# EAGLE design M708B (EAGLE 6.6.0)
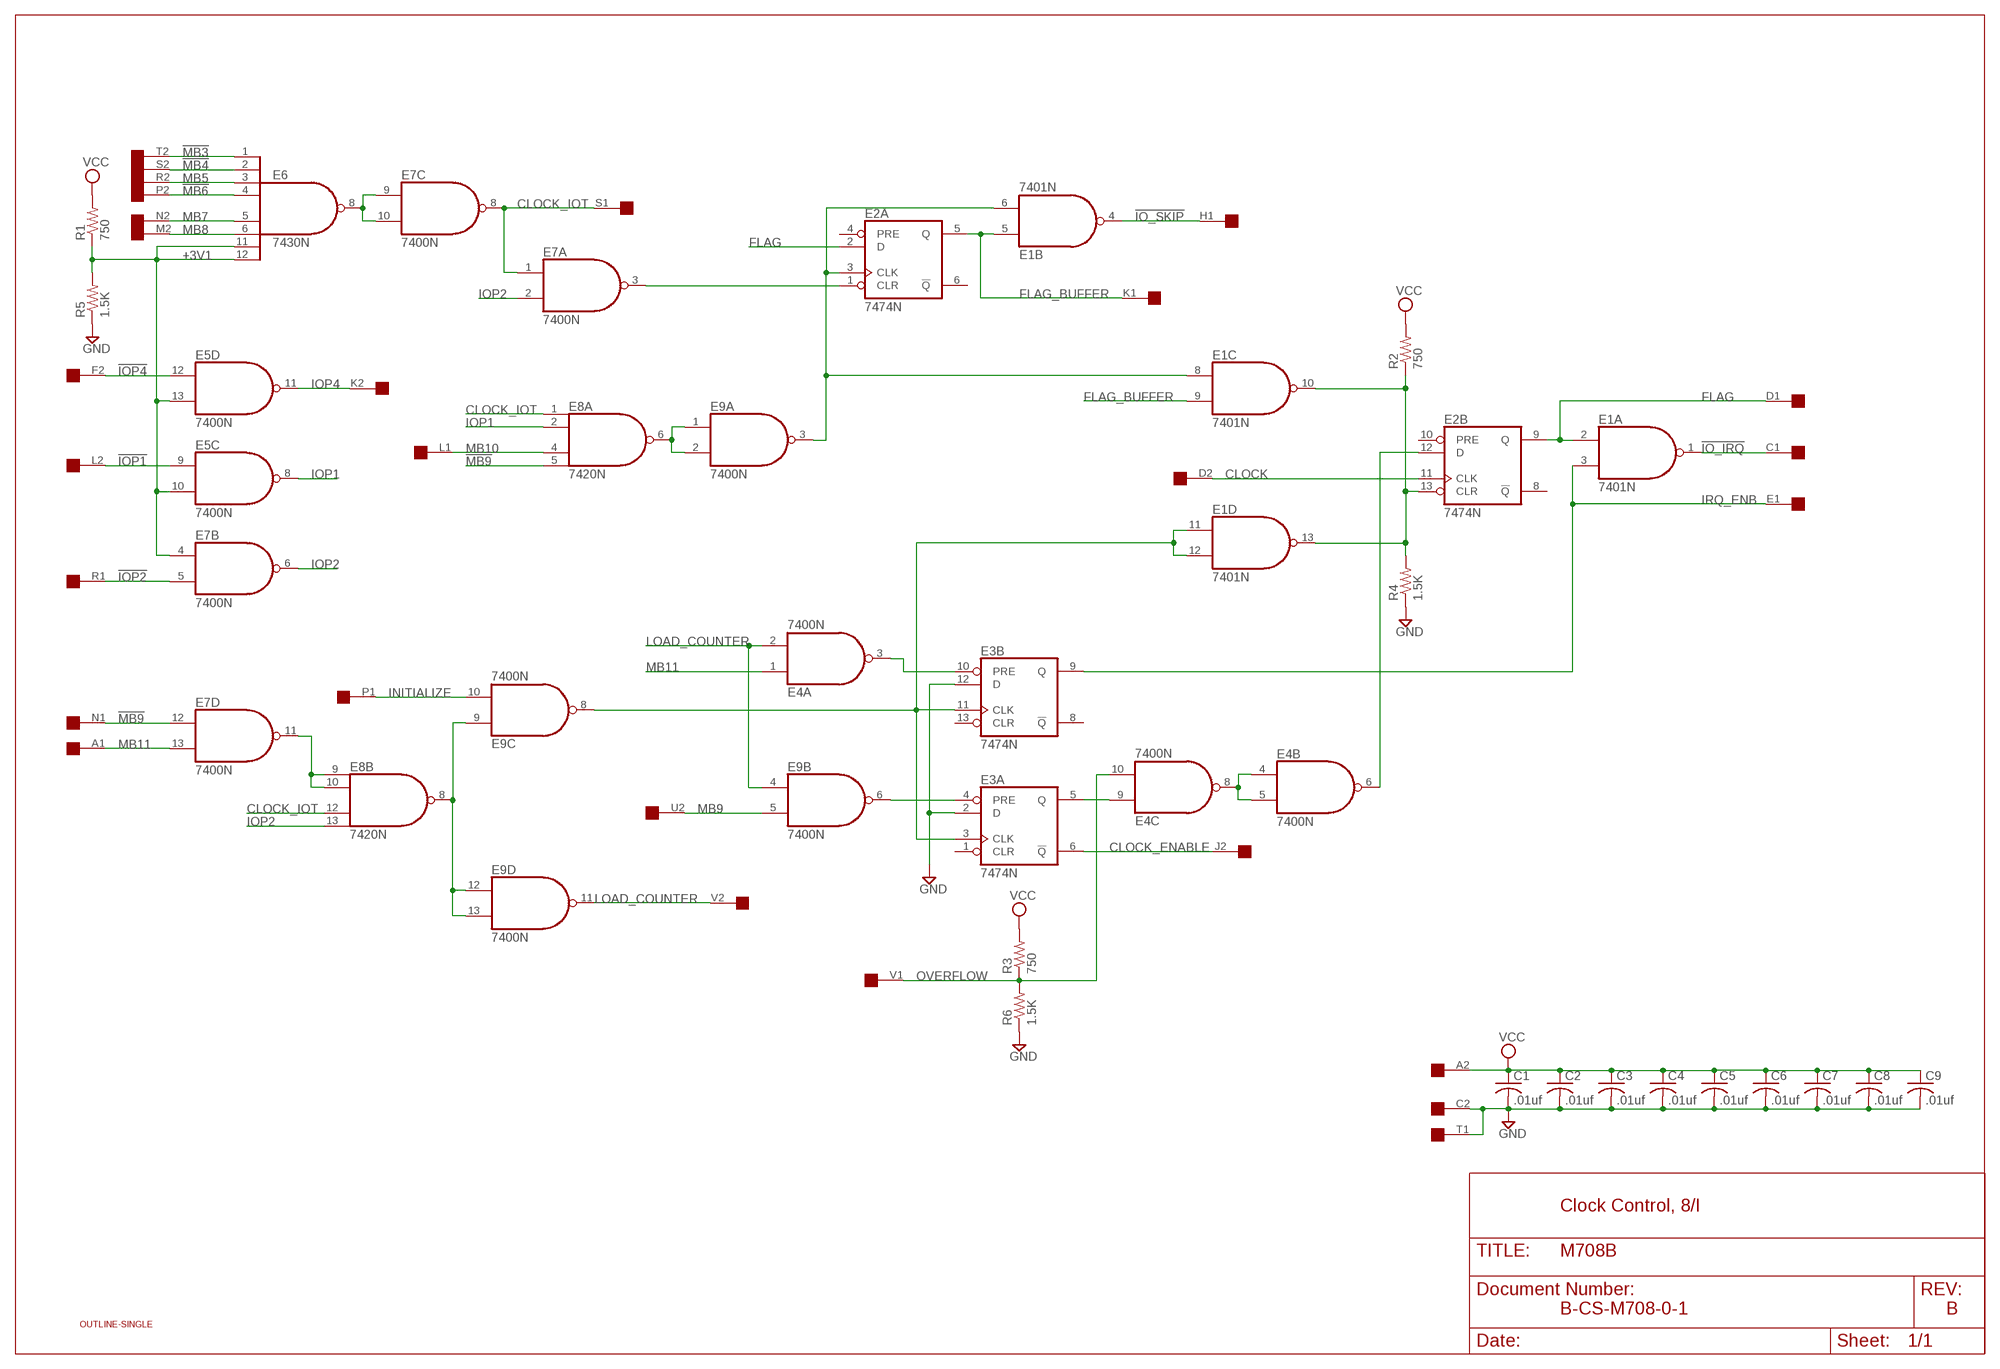
[diagram p0: schematic, sheet 1]

## Parts
C1  .01uf  C-US075-032X103  [C075-032X103]
C2  .01uf  C-US075-032X103  [C075-032X103]
C3  .01uf  C-US075-032X103  [C075-032X103]
C4  .01uf  C-US075-032X103  [C075-032X103]
C5  .01uf  C-US075-032X103  [C075-032X103]
C6  .01uf  C-US075-032X103  [C075-032X103]
C7  .01uf  C-US075-032X103  [C075-032X103]
C8  .01uf  C-US075-032X103  [C075-032X103]
C9  .01uf  C-US075-032X103  [C075-032X103]
E1  7401N  74LS01N  [DIL14]
E2  7474N  74S74N  [DIL14]
E3  7474N  74S74N  [DIL14]
E4  7400N  [DIL14]
E5  7400N  [DIL14]
E6  7430N  [DIL14]
E7  7400N  [DIL14]
E8  7420N  74S20N  [DIL14]
E9  7400N  [DIL14]
R1  750  R-US_0207/10  [0207/10]
R2  750  R-US_0207/10  [0207/10]
R3  750  R-US_0207/10  [0207/10]
R4  1.5K  R-US_0207/10  [0207/10]
R5  1.5K  R-US_0207/10  [0207/10]
R6  1.5K  R-US_0207/10  [0207/10]
U$1  SINGLE  [EDGE-CON2]
U$4  OUTLINE-SINGLE  [SINGLE]

## Nets
!CLR_FLAG: E1.10(C:O) E1.13(D:O) E2.13(B:CLR) R2.1 R4.2
!IO_IRQ: E1.1(A:O) U$1.C1
!IO_SKIP: E1.4(B:O) U$1.H1
!IOP1: E5.9(C:I0) U$1.L2
!IOP2: E7.5(B:I1) U$1.R1
!IOP4: E5.12(D:I0) U$1.F2
!MB3: E6.1(I0) U$1.T2
!MB4: E6.2(I1) U$1.S2
!MB6: E6.4(I3) U$1.P2
!MB9: E7.12(D:I0) E8.5(A:I3) U$1.N1
+3V1: E5.10(C:I1) E5.13(D:I1) E6.11(I6) E6.12(I7) E7.4(B:I0) R1.1 R5.2
CLOCK: E2.11(B:CLK) U$1.D2
CLOCK_ENABLE: E3.6(A:!Q) U$1.J2
CLOCK_IOT: E7.1(A:I0) E7.8(C:O) E8.1(A:I0) E8.12(B:I2) U$1.S1
FLAG: E1.2(A:I0) E2.2(A:D) E2.9(B:Q) U$1.D1
FLAG_BUFFER: E1.5(B:I0) E1.9(C:I1) E2.5(A:Q) U$1.K1
GND [Supply]: C1.2 C2.2 C3.2 C4.2 C5.2 C6.2 C7.2 C8.2 C9.2 E3.2(A:D) E3.12(B:D) R4.1 R5.1 R6.1 U$1.C2 U$1.T1
INITIALIZE: E9.10(C:I1) U$1.P1
IOP1: E5.8(C:O) E8.2(A:I1)
IOP2: E7.2(A:I1) E7.6(B:O) E8.13(B:I3)
IOP4: E5.11(D:O) U$1.K2
IRQ_ENB: E1.3(A:I1) E3.9(B:Q) U$1.E1
LOAD_COUNTER: E4.2(A:I1) E9.4(B:I0) E9.11(D:O) U$1.V2
MB5: E6.3(I2) U$1.R2
MB7: E6.5(I4) U$1.N2
MB8: E6.6(I5) U$1.M2
MB9: E9.5(B:I1) U$1.U2
MB10: E8.4(A:I2) U$1.L1
MB11: E4.1(A:I0) E7.13(D:I1) U$1.A1
N$14: E1.11(D:I0) E1.12(D:I1) E3.3(A:CLK) E3.11(B:CLK) E9.8(C:O)
N$26: E6.8(O) E7.9(C:I0) E7.10(C:I1)
N$29: E2.1(A:CLR) E7.3(A:O)
N$31: E8.6(A:O) E9.1(A:I0) E9.2(A:I1)
N$32: E1.6(B:I1) E1.8(C:I0) E2.3(A:CLK) E9.3(A:O)
N$34: E7.11(D:O) E8.9(B:I0) E8.10(B:I1)
N$35: E8.8(B:O) E9.9(C:I0) E9.12(D:I0) E9.13(D:I1)
N$36: E3.5(A:Q) E4.9(C:I0)
N$37: E3.4(A:PRE) E9.6(B:O)
N$38: E3.10(B:PRE) E4.3(A:O)
N$40: E4.4(B:I0) E4.5(B:I1) E4.8(C:O)
N$41: E2.12(B:D) E4.6(B:O)
OVERFLOW: E4.10(C:I1) R3.1 R6.2 U$1.V1
VCC [Supply]: C1.1 C2.1 C3.1 C4.1 C5.1 C6.1 C7.1 C8.1 C9.1 R1.2 R2.2 R3.2 U$1.A2
Unconnected: E2.4(A:PRE) E2.6(A:!Q) E2.8(B:!Q) E2.10(B:PRE) E3.1(A:CLR) E3.8(B:!Q) E3.13(B:CLR) E4.11(D:O) E4.12(D:I0) E4.13(D:I1) E5.1(A:I0) E5.2(A:I1) E5.3(A:O) E5.4(B:I0) E5.5(B:I1) E5.6(B:O) U$1.B1 U$1.B2 U$1.E2 U$1.F1 U$1.H2 U$1.J1 U$1.M1 U$1.U1

## Notes on the sheet
- Clock Control, 8/I
- B-CS-M708-0-1 | B

## Power pins joined to a net without a drawn wire
GND: E1.7(P:GND) E2.7(P:GND) E3.7(P:GND) E4.7(P:GND) E5.7(P:GND) E6.7(GND) E7.7(P:GND) E8.7(P:GND) E9.7(P:GND)
VCC: E1.14(P:VCC) E2.14(P:VCC) E3.14(P:VCC) E4.14(P:VCC) E5.14(P:VCC) E6.14(VCC) E7.14(P:VCC) E8.14(P:VCC) E9.14(P:VCC)

## Library data of the parts
C1-C9 = rcl:C-US: CAPACITOR, American symbol
E1 = 74xx-us:74*01: Quad 2-input NAND gate, open collector
E2 E3 = 74xx-us:74*74: Dual D type positive edge triggered FLIP FLOP, preset and clear
E4 E5 E7 E9 = 74xx-us:74*00: Quad 2-input NAND gate
E6 = 74xx-us:74*30: 8-input NAND gate
E8 = 74xx-us:74*20: Dual 4-input NAND gate
R1-R6 = rcl:R-US_: RESISTOR, American symbol
U$1 = dec-con:SINGLE: Single-Height DEC board
U$4 = dec-con:OUTLINE-*: Board outlines for DEC boards.

## Net classes
1 Supply: width 0.813 mm

## Board
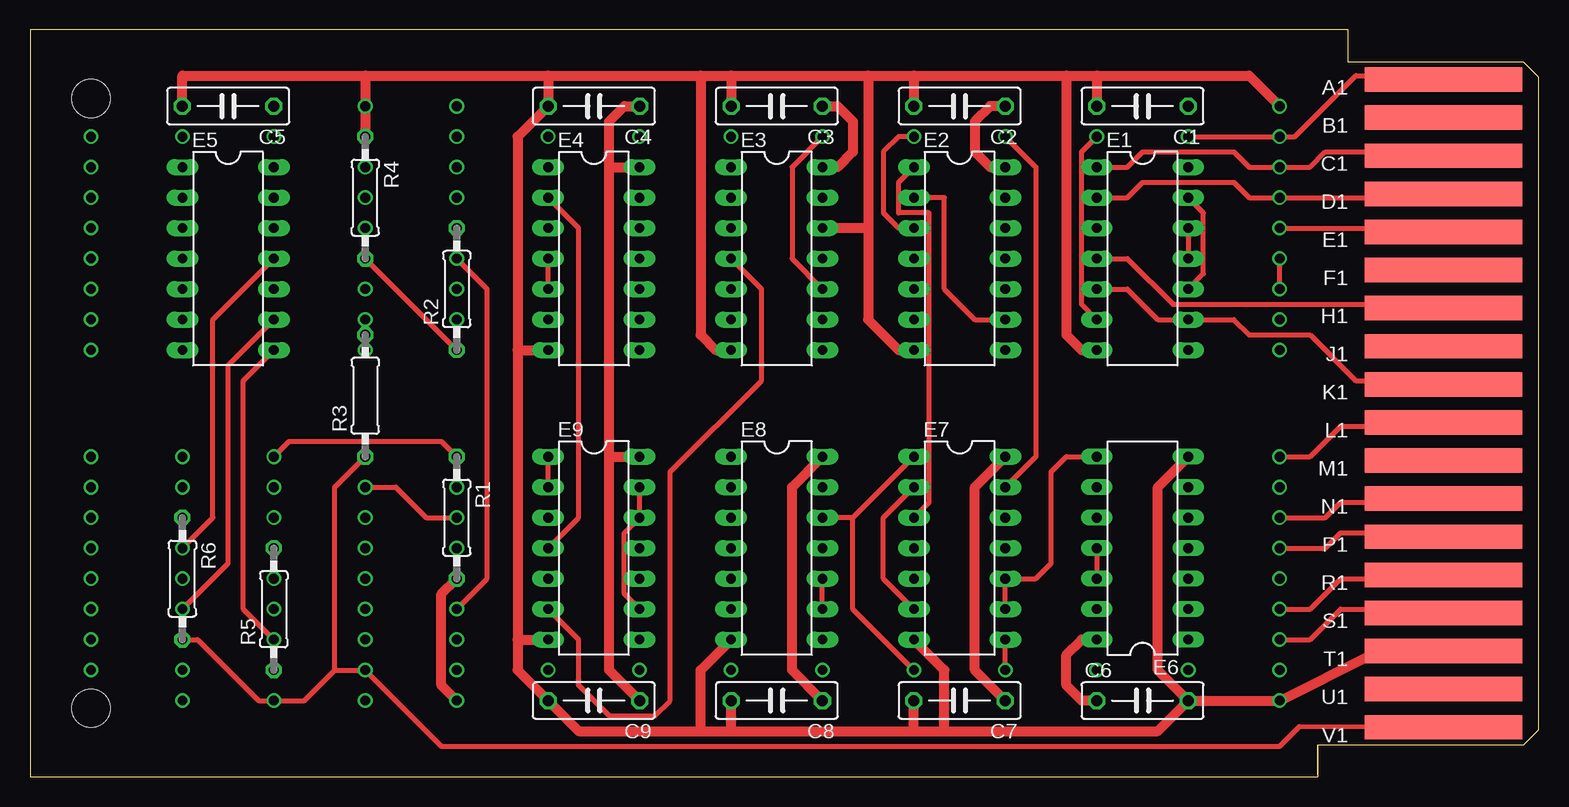
[diagram p1: board, top side]
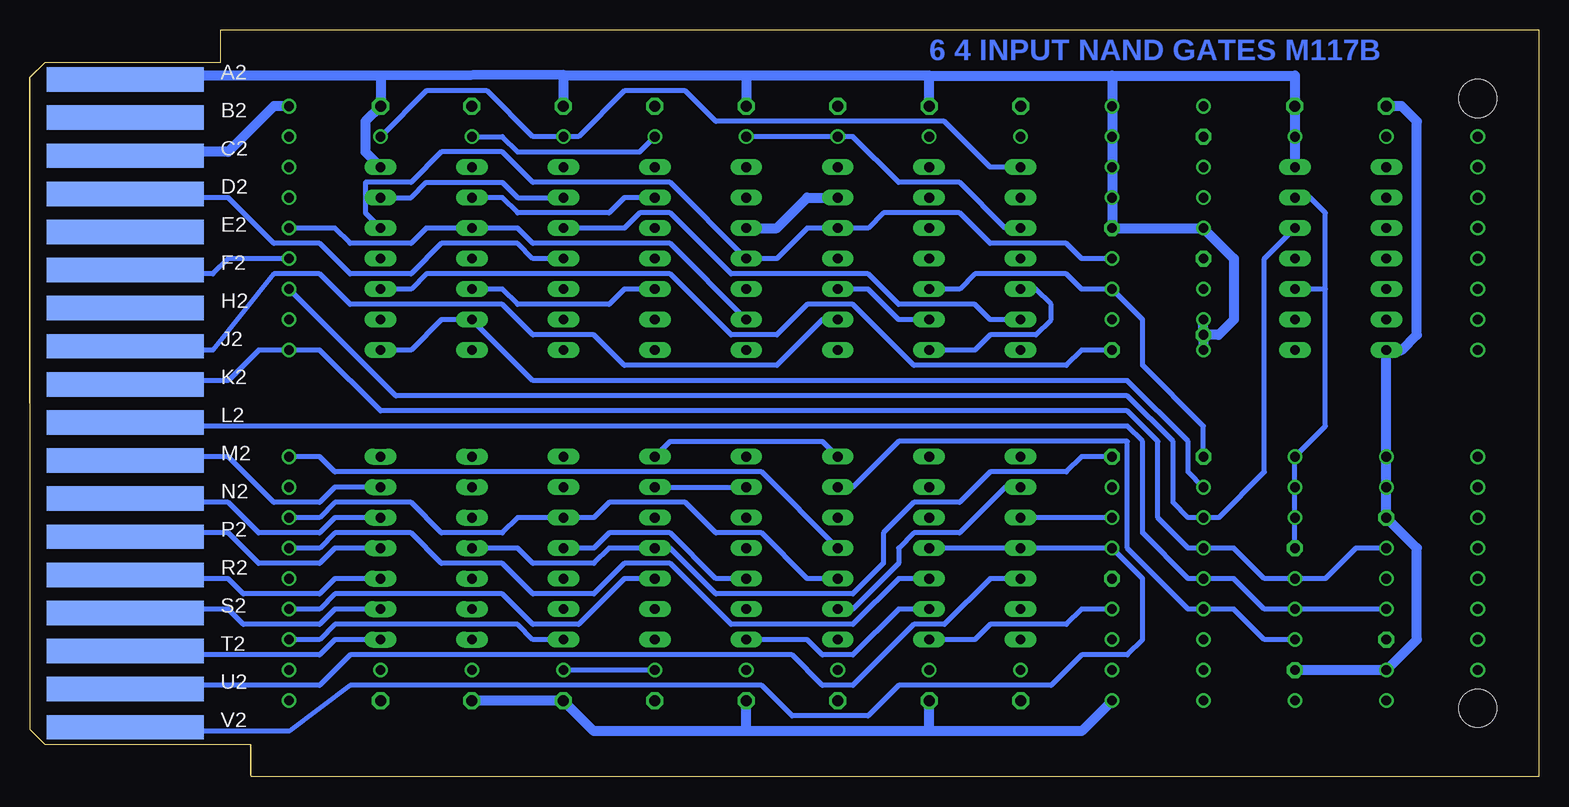
[diagram p2: board, bottom side, seen from below]

Size 125.73 x 62.23 mm. Coordinates in mm from the lower left corner, seen from the top.
Copper layers (1+16): Top 0.035mm / dielectric 1.5mm / Bottom 0.035mm
Design rules "16mils": minimum track width 16mil, minimum drill 32mil, track to track 15mil, track to pad 10mil, pad to pad 10mil, via to via 10mil, smd to smd 10mil, copper to edge 13mil, drill to drill 10mil, minimum pad ring 10mil, minimum via ring 8mil, stop-mask expansion 0mil, vias tented up to drill 0mil, thermal gap 10mil

### Footprints (pad centres in the part's own frame; a part is rotated, then mirrored left to right if it is on the bottom)
C075-032X103 = drill 0.914 octagon: 1 -3.81,0; 2 3.81,0
DIL14 = drill 0.813 long: 1 -7.62,-3.81; 2 -5.08,-3.81; 3 -2.54,-3.81; 4 0,-3.81; 5 2.54,-3.81; 6 5.08,-3.81; 7 7.62,-3.81; 8 7.62,3.81; 9 5.08,3.81; 10 2.54,3.81; 11 0,3.81; 12 -2.54,3.81; 13 -5.08,3.81; 14 -7.62,3.81
0207/10 = drill 0.813 octagon: 1 -5.08,0; 2 5.08,0
EDGE-CON2 = smd 13.106 x 2.032: A1 7.938,4.128; B1 7.938,7.303; C1 7.938,10.477; D1 7.938,13.652; E1 7.938,16.828; F1 7.938,20.003; H1 7.938,23.177; J1 7.938,26.352; K1 7.938,29.527; L1 7.938,32.703; M1 7.938,35.877; N1 7.938,39.053; P1 7.938,42.227; R1 7.938,45.403; S1 7.938,48.578; T1 7.938,51.752; U1 7.938,54.928; V1 7.938,58.102 | smd 13.106 x 2.032 bottom: A2 7.938,4.128; B2 7.938,7.303; C2 7.938,10.477; D2 7.938,13.652; E2 7.938,16.828; F2 7.938,20.003; H2 7.938,23.177; J2 7.938,26.352; K2 7.938,29.527; L2 7.938,32.703; M2 7.938,35.877; N2 7.938,39.053; P2 7.938,42.227; R2 7.938,45.403; S2 7.938,48.578; T2 7.938,51.752; U2 7.938,54.928; V2 7.938,58.102
SINGLE = hole 3.175: 120.65,56.515; 120.65,5.715

### Placement (x,y rotation side)
C1  92.71,55.88 180 top
C2  77.47,55.88 180 top
C3  62.23,55.88 180 top
C4  46.99,55.88 180 top
C5  16.51,55.88 180 top
C6  92.71,6.35 0 top
C7  77.47,6.35 180 top
C8  62.23,6.35 180 top
C9  46.99,6.35 180 top
E1  92.71,43.18 270 top
E2  77.47,43.18 270 top
E3  62.23,43.18 270 top
E4  46.99,43.18 270 top
E5  16.51,43.18 270 top
E6  92.71,19.05 90 top
E7  77.47,19.05 270 top
E8  62.23,19.05 270 top
E9  46.99,19.05 270 top
R1  35.56,21.59 270 top
R2  35.56,40.64 90 top
R3  27.94,31.75 90 top
R4  27.94,48.26 270 top
R5  20.32,13.97 90 top
R6  12.7,16.51 270 top
U$1  125.73,62.23 180 top
U$4  125.73,62.23 180 top

### Tracks (layer width: path | path; a pad name or v marks a point on that pad's centre or on a via)
!CLR_FLAG
  Top 0.406: E1.10 97.79,41.91 97.79,46.99 E1.13 | R2.1 R4.2
  Bottom 0.406: E1.13 93.98,48.26 92.71,49.53 86.36,49.53 85.09,48.26 E2.13 | E1.10 93.98,40.64 92.71,41.91 72.39,41.91 67.31,36.83 63.5,36.83 60.96,39.37 57.15,39.37 52.07,34.29 39.37,34.29 38.1,35.56 R2.1
!IO_IRQ  (via drill 0.81)
  Top 0.406: U$1.C1 112.09,51.74 111.76,52.07 107.95,52.07 106.68,50.8 v104.14,50.8 101.6,50.8 100.33,52.07 92.71,52.07 91.44,50.8 E1.1
!IO_SKIP
  Top 0.406: U$1.H1 112.09,39.04 111.76,39.37 95.25,39.37 91.44,43.18 E1.4
!IOP1  (via drill 0.81)
  Top 0.406: E5.9 16.51,34.29 16.51,17.78 v12.7,13.97
  Bottom 0.406: U$1.L2 112.09,29.54 111.76,29.21 107.95,29.21 34.29,29.21 33.02,27.94 33.02,20.32 29.21,16.51 v27.94,16.51 25.4,16.51 22.86,13.97 v20.32,13.97 v12.7,13.97
!IOP2  (via drill 0.81)
  Top 0.406: U$1.R1 112.09,16.84 111.76,16.51 109.22,16.51 106.68,13.97 v104.14,13.97
  Bottom 0.406: v104.14,13.97 101.6,13.97 100.33,15.24 86.36,15.24 83.82,12.7 80.01,12.7 76.2,16.51 E7.5
!IOP4  (via drill 0.81)
  Top 0.406: v104.14,40.64 v104.14,43.18
  Bottom 0.406: U$1.F2 112.75,42.19 111.76,41.91 110.49,41.91 109.22,43.18 v104.14,43.18 | v104.14,40.64 95.25,31.75 34.29,31.75 30.48,27.94 30.48,22.86 29.21,21.59 v27.94,21.59 26.67,21.59 22.86,25.4 22.86,43.18 E5.12
!MB3
  Bottom 0.406: U$1.T2 112.09,10.49 111.76,10.16 101.6,10.16 100.33,11.43 E6.1
!MB4
  Bottom 0.406: U$1.S2 112.06,13.66 111.76,13.97 109.22,13.97 107.95,12.7 101.6,12.7 100.33,13.97 E6.2
!MB6
  Bottom 0.406: U$1.P2 112.09,19.99 111.76,20.32 109.22,20.32 106.68,17.78 101.6,17.78 100.33,19.05 E6.4
!MB9  (via drill 0.81)
  Top 0.406: U$1.N1 112.09,23.19 111.76,22.86 109.22,22.86 107.95,21.59 v104.14,21.59
  Bottom 0.406: v104.14,21.59 101.6,21.59 100.33,22.86 93.98,22.86 91.44,20.32 86.36,20.32 85.09,21.59 E7.12 78.74,21.59 77.47,22.86 71.12,22.86 68.58,20.32 64.77,20.32 60.96,16.51 E8.5
+3V1  (via drill 0.81)
  Top 0.406: v20.32,26.67 21.59,27.94 34.29,27.94 R1.1 | E6.11 E6.12
  Bottom 0.406: R5.2 v20.32,21.59 v20.32,24.13 v20.32,26.67 17.78,29.21 17.78,40.64 | E6.11 85.09,19.05 83.82,17.78 78.74,17.78 77.47,19.05 E7.4 72.39,19.05 68.58,15.24 57.15,15.24 54.61,17.78 54.61,20.32 52.07,22.86 48.26,22.86 45.72,25.4 39.37,25.4 38.1,26.67 R1.1 | 17.78,40.64 17.78,46.99 19.05,48.26 E5.13 | 17.78,40.64 E5.10
CLOCK
  Bottom 0.406: U$1.D2 112.06,48.56 111.76,48.26 109.22,48.26 105.41,44.45 101.6,44.45 99.06,41.91 93.98,41.91 91.44,44.45 85.09,44.45 83.82,43.18 E2.11
CLOCK_ENABLE
  Bottom 0.406: U$1.J2 112.09,35.89 111.76,35.56 110.49,35.56 105.41,41.91 101.6,41.91 99.06,39.37 86.36,39.37 83.82,36.83 78.74,36.83 76.2,34.29 63.5,34.29 59.69,38.1 E3.6
CLOCK_IOT  (via drill 0.81)
  Top 0.406: U$1.S1 112.06,13.66 111.76,13.97 109.22,13.97 106.68,11.43 v104.14,11.43 | 68.58,21.59 68.58,13.97 v73.66,8.89 | v81.28,8.89 E7.8 | 68.58,21.59 E7.1 | 68.58,21.59 E8.12
  Bottom 0.406: v104.14,11.43 101.6,11.43 100.33,12.7 85.09,12.7 83.82,11.43 E7.8 | v73.66,8.89 v81.28,8.89 | E8.1 59.69,27.94 72.39,27.94 E7.1
FLAG  (via drill 0.81)
  Top 0.406: U$1.D1 112.06,48.56 111.76,48.26 v104.14,48.26 101.6,48.26 100.33,49.53 92.71,49.53 91.44,48.26 E1.2 | E2.9 78.74,38.1 76.2,40.64 76.2,48.26 E2.2
  Bottom 0.406: E1.2 86.36,48.26 85.09,46.99 77.47,46.99 76.2,48.26 E2.2
FLAG_BUFFER
  Top 0.406: U$1.K1 112.06,32.72 111.76,33.02 110.49,33.02 106.68,36.83 101.6,36.83 100.33,38.1 E1.9 93.98,38.1 91.44,40.64 E1.5
  Bottom 0.406: E1.5 86.36,40.64 85.09,39.37 77.47,39.37 76.2,40.64 E2.5
GND  (via drill 0.81)
  Top 0.813: 73.66,58.42 86.36,58.42 | U$1.T1 111.76,10.16 v104.14,6.35 C6.2 | 43.18,58.42 C4.2 40.64,53.34 40.64,35.56 | 43.18,58.42 55.88,58.42 | 58.42,58.42 69.85,58.42 | C5.2 12.7,58.42 27.94,58.42 | 27.94,58.42 43.18,58.42 | 40.64,35.56 E4.7 | E3.7 57.15,35.56 55.88,36.83 55.88,58.42 | 55.88,58.42 58.42,58.42 | 58.42,58.42 C3.2 | E2.7 72.39,35.56 69.85,38.1 69.85,45.72 | 69.85,58.42 69.85,45.72 | 69.85,58.42 73.66,58.42 | 73.66,58.42 C2.2 | E1.7 87.63,35.56 86.36,36.83 86.36,58.42 | 86.36,58.42 88.9,58.42 | 88.9,58.42 C1.2 | 88.9,58.42 101.6,58.42 v104.14,55.88 | 40.64,11.43 40.64,8.89 C9.2 45.72,3.81 55.88,3.81 | 40.64,11.43 E9.7 | 40.64,35.56 40.64,11.43 | C6.2 93.98,3.81 76.2,3.81 | 55.88,3.81 58.42,3.81 | 58.42,3.81 73.66,3.81 | 73.66,3.81 76.2,3.81 | 58.42,3.81 C8.2 | E8.7 55.88,8.89 55.88,3.81 | E7.7 76.2,8.89 76.2,3.81 | 73.66,3.81 C7.2 | 69.85,45.72 E3.12 | E6.7 93.98,24.13 93.98,8.89 C6.2 | 27.94,58.42 v27.94,55.88 R4.1
  Bottom 0.813: U$1.C2 112.09,51.74 111.76,52.07 109.22,52.07 105.41,55.88 v104.14,55.88 | R5.1 v12.7,8.89 10.16,11.43 10.16,19.05 R6.1 v12.7,24.13 v12.7,26.67 E5.7 11.43,35.56 10.16,36.83 10.16,54.61 11.43,55.88 C5.2 | E3.12 63.5,45.72 60.96,48.26 E3.2
INITIALIZE  (via drill 0.81)
  Top 0.406: U$1.P1 112.09,19.99 111.76,20.32 109.22,20.32 107.95,19.05 v104.14,19.05
  Bottom 0.406: v104.14,19.05 101.6,19.05 100.33,20.32 93.98,20.32 91.44,17.78 86.36,17.78 83.82,15.24 78.74,15.24 76.2,17.78 72.39,17.78 67.31,12.7 57.15,12.7 53.34,16.51 E9.10
IOP1  (via drill 0.81)
  Top 0.406: v20.32,11.43 17.78,13.97 17.78,33.02 E5.8
  Bottom 0.406: E8.2 57.15,24.13 53.34,27.94 34.29,27.94 34.29,19.05 29.21,13.97 v27.94,13.97 25.4,13.97 22.86,11.43 v20.32,11.43
IOP2
  Top 0.406: E7.6 71.12,16.51 71.12,21.59 E7.2
  Bottom 0.406: E7.2 E8.13
IOP4  (via drill 0.81)
  Top 0.406: E5.11 15.24,38.1 15.24,21.59 v12.7,19.05
  Bottom 0.406: U$1.K2 112.06,32.72 111.76,33.02 109.22,33.02 106.68,35.56 v104.14,35.56 101.6,35.56 96.52,30.48 34.29,30.48 31.75,27.94 31.75,21.59 29.21,19.05 v27.94,19.05 25.4,19.05 22.86,16.51 v20.32,16.51 17.78,16.51 15.24,19.05 v12.7,19.05
IRQ_ENB  (via drill 0.81)
  Top 0.406: U$1.E1 112.09,45.39 111.76,45.72 v104.14,45.72
  Bottom 0.406: v104.14,45.72 100.33,45.72 99.06,44.45 93.98,44.45 92.71,45.72 E1.3 85.09,45.72 83.82,44.45 72.39,44.45 E3.9
LOAD_COUNTER  (via drill 0.81)
  Top 0.406: E9.4 45.72,21.59 45.72,45.72 E4.2
  Bottom 0.406: U$1.V2 112.15,4.2 111.76,3.81 104.14,3.81 99.06,7.62 64.77,7.62 62.23,5.08 55.88,5.08 53.34,7.62 40.64,7.62 38.1,10.16 34.29,10.16 33.02,11.43 33.02,16.51 v35.56,19.05 E9.4 E9.11
MB5
  Bottom 0.406: U$1.R2 112.09,16.84 111.76,16.51 109.22,16.51 107.95,15.24 101.6,15.24 100.33,16.51 E6.3
MB7
  Bottom 0.406: U$1.N2 112.09,23.19 111.76,22.86 109.22,22.86 106.68,20.32 101.6,20.32 100.33,21.59 E6.5
MB8
  Bottom 0.406: U$1.M2 112.09,26.34 111.76,26.67 109.22,26.67 105.41,22.86 101.6,22.86 100.33,24.13 E6.6
MB9
  Bottom 0.406: U$1.U2 112.12,7.26 111.76,7.62 101.6,7.62 99.06,10.16 62.23,10.16 59.69,7.62 57.15,7.62 52.07,12.7 49.53,12.7 45.72,16.51 E9.5
MB10  (via drill 0.81)
  Top 0.406: U$1.L1 112.09,29.54 111.76,29.21 109.22,29.21 106.68,26.67 v104.14,26.67
  Bottom 0.406: v104.14,26.67 101.6,26.67 100.33,25.4 64.77,25.4 E8.4
MB11  (via drill 0.81)
  Top 0.406: U$1.A1 112.16,58.02 111.76,58.42 110.49,58.42 105.41,53.34 v104.14,53.34 v96.52,53.34 | E7.13 83.82,26.67 83.82,50.8 v81.28,53.34
  Bottom 0.406: v96.52,53.34 92.71,57.15 87.63,57.15 83.82,53.34 v81.28,53.34 80.01,53.34 76.2,57.15 71.12,57.15 68.58,54.61 49.53,54.61 45.72,50.8 E4.1
N$1  (via drill 0.81)
  other vias: 5.08,53.34
N$2  (via drill 0.81)
  other vias: 5.08,50.8
N$3  (via drill 0.81)
  other vias: 5.08,48.26
N$4  (via drill 0.81)
  other vias: 5.08,45.72
N$5  (via drill 0.81)
  other vias: 5.08,43.18
N$6  (via drill 0.81)
  other vias: 5.08,40.64
N$7  (via drill 0.81)
  other vias: 5.08,38.1
N$8  (via drill 0.81)
  other vias: 5.08,35.56
N$10  (via drill 0.81)
  other vias: 104.14,38.1
N$14  (via drill 0.81)
  Top 0.406: E1.12 E1.11 | v35.56,43.18 38.1,40.64 38.1,16.51 v35.56,13.97
  Bottom 0.406: E1.12 97.79,46.99 97.79,49.53 93.98,49.53 91.44,52.07 86.36,52.07 83.82,49.53 72.39,49.53 E3.11 63.5,43.18 60.96,45.72 E3.3 55.88,45.72 54.61,46.99 48.26,46.99 45.72,44.45 39.37,44.45 38.1,43.18 v35.56,43.18 | v35.56,13.97 38.1,13.97 39.37,12.7 45.72,12.7 46.99,11.43 E9.8
N$18  (via drill 0.81)
  other vias: 5.08,8.89
N$19  (via drill 0.81)
  other vias: 5.08,11.43
N$20  (via drill 0.81)
  other vias: 5.08,13.97
N$21  (via drill 0.81)
  other vias: 5.08,16.51
N$22  (via drill 0.81)
  other vias: 5.08,19.05
N$23  (via drill 0.81)
  other vias: 5.08,21.59
N$24  (via drill 0.81)
  other vias: 5.08,24.13
N$25  (via drill 0.81)
  other vias: 5.08,26.67
N$26
  Top 0.406: E7.9 E7.10 83.82,16.51 85.09,17.78 85.09,25.4 86.36,26.67 E6.8
N$27  (via drill 0.81)
  other vias: 104.14,24.13
N$28  (via drill 0.81)
  other vias: 104.14,16.51
N$29
  Top 0.406: E2.1 72.39,49.53 72.39,46.99 74.93,46.99 74.93,22.86 E7.3
N$31
  Top 0.406: E9.2 E9.1
  Bottom 0.406: E9.2 44.45,24.13 48.26,20.32 52.07,20.32 53.34,19.05 53.34,17.78 57.15,13.97 E8.6
N$32  (via drill 0.81)
  Top 0.406: E2.3 72.39,45.72 71.12,46.99 71.12,52.07 72.39,53.34 v73.66,53.34 | v35.56,21.59 33.02,21.59 30.48,24.13 v27.94,24.13 | E1.6 87.63,39.37 87.63,52.07 v88.9,53.34
  Bottom 0.406: E1.8 93.98,35.56 91.44,38.1 E1.6 83.82,33.02 38.1,33.02 34.29,33.02 29.21,27.94 29.21,25.4 v27.94,24.13 | v73.66,53.34 74.93,52.07 85.09,52.07 86.36,53.34 v88.9,53.34 | v35.56,21.59 E9.3
N$33  (via drill 0.81)
  other vias: 104.14,8.89
N$34
  Top 0.406: E8.9 E8.10
  Bottom 0.406: E7.11 78.74,19.05 77.47,20.32 72.39,20.32 68.58,16.51 E8.10
N$35
  Top 0.406: E9.13 E9.12 49.53,20.32 49.53,15.24 E9.9
  Bottom 0.406: E8.8 60.96,11.43 59.69,10.16 57.15,10.16 53.34,13.97 E9.9
N$36
  Bottom 0.406: E3.5 55.88,40.64 53.34,38.1 52.07,38.1 E4.9
N$37
  Top 0.406: E3.4 60.96,40.64 60.96,33.02 53.34,25.4 53.34,6.35 52.07,5.08 48.26,5.08 45.72,7.62 45.72,11.43 E9.6
N$38  (via drill 0.81)
  Top 0.406: E3.10 63.5,43.18 63.5,50.8 v66.04,53.34
  Bottom 0.406: v66.04,53.34 v58.42,53.34 57.15,53.34 53.34,49.53 48.26,49.53 44.45,45.72 E4.3
N$40
  Top 0.406: E4.5 E4.4
  Bottom 0.406: E4.8 46.99,35.56 45.72,36.83 41.91,36.83 40.64,38.1 40.64,39.37 41.91,40.64 E4.5
N$41
  Bottom 0.406: E2.12 76.2,45.72 74.93,46.99 72.39,46.99 67.31,41.91 55.88,41.91 53.34,39.37 46.99,39.37 45.72,38.1 E4.6
N$42  (via drill 0.81)
  other vias: 12.7,53.34
N$66  (via drill 0.81)
  other vias: 12.7,16.51
N$70  (via drill 0.81)
  other vias: 12.7,6.35
N$74  (via drill 0.81)
  other vias: 27.94,40.64
N$76  (via drill 0.81)
  other vias: 27.94,48.26
N$77  (via drill 0.81)
  other vias: 27.94,50.8
N$86  (via drill 0.81)
  other vias: 27.94,11.43
N$88  (via drill 0.81)
  other vias: 27.94,6.35
N$90  (via drill 0.81)
  other vias: 35.56,38.1
N$99  (via drill 0.81)
  other vias: 35.56,24.13
N$104  (via drill 0.81)
  other vias: 35.56,11.43
N$105  (via drill 0.81)
  other vias: 35.56,8.89
N$114  (via drill 0.81)
  other vias: 43.18,53.34
N$123  (via drill 0.81)
  other vias: 43.18,8.89
N$132  (via drill 0.81)
  other vias: 50.8,53.34
N$141  (via drill 0.81)
  other vias: 50.8,8.89
N$177  (via drill 0.81)
  other vias: 66.04,8.89
N$188  (via drill 0.81)
  other vias: 58.42,8.89
N$207  (via drill 0.81)
  other vias: 88.9,8.89
N$225  (via drill 0.81)
  other vias: 96.52,8.89
OVERFLOW  (via drill 0.81)
  Top 0.406: U$1.V1 105.8,4.2 104.14,2.54 34.29,2.54 v27.94,8.89 25.4,8.89 | 25.4,8.89 22.86,6.35 v20.32,6.35 19.05,6.35 13.97,11.43 R6.2 | R3.1 25.4,24.13 25.4,8.89
  Bottom 0.406: E4.10 48.26,40.64 46.99,41.91 39.37,41.91 38.1,40.64 v35.56,40.64 33.02,38.1 33.02,34.29 27.94,29.21 R3.1
VCC  (via drill 0.81)
  Top 0.813: R1.2 34.29,15.24 34.29,7.62 v35.56,6.35 | E6.14 87.63,11.43 86.36,10.16 86.36,7.62 87.63,6.35 C6.1 | E2.14 80.01,50.8 78.74,52.07 78.74,54.61 80.01,55.88 C2.1 | E3.14 67.31,50.8 68.58,52.07 68.58,54.61 67.31,55.88 C3.1 | C4.1 49.53,55.88 48.26,54.61 48.26,50.8 | 48.26,50.8 E4.14 | C9.1 48.26,8.89 48.26,26.67 | 48.26,26.67 E9.14 | E8.14 63.5,24.13 63.5,8.89 C8.1 | E7.14 78.74,24.13 78.74,8.89 C7.1 | 48.26,26.67 48.26,50.8
  Bottom 0.813: 96.52,58.42 113.03,58.42 113.43,58.02 U$1.A2 | 81.28,58.42 C2.1 | 81.28,58.42 81.28,58.5 96.52,58.42 | E1.14 97.79,52.07 97.79,54.61 C1.1 96.52,58.42 | 35.56,58.42 20.32,58.42 C5.1 v20.32,53.34 E5.14 | 50.8,58.42 35.56,58.42 | 50.8,58.42 66.04,58.42 | 66.04,58.42 81.28,58.42 | 35.56,58.42 v35.56,55.88 v35.56,53.34 v35.56,50.8 v35.56,48.26 R2.2 v27.94,45.72 25.4,43.18 25.4,38.1 26.67,36.83 R3.2 | C6.1 C7.1 78.74,3.81 66.04,3.81 | 50.8,3.81 38.1,3.81 v35.56,6.35 | 50.8,3.81 66.04,3.81 | 50.8,3.81 C9.1 | 66.04,3.81 C8.1 | C4.1 50.8,58.42 | 66.04,58.42 C3.1 | R3.2 v27.94,38.1 | R3.2 v27.94,35.56

### Text on the board
Bottom: 6 4 INPUT NAND GATES M117B